# Altium schematic sheet LCD_big.SchDoc
size A4; SheetNumber: 2; SheetTotal: 2
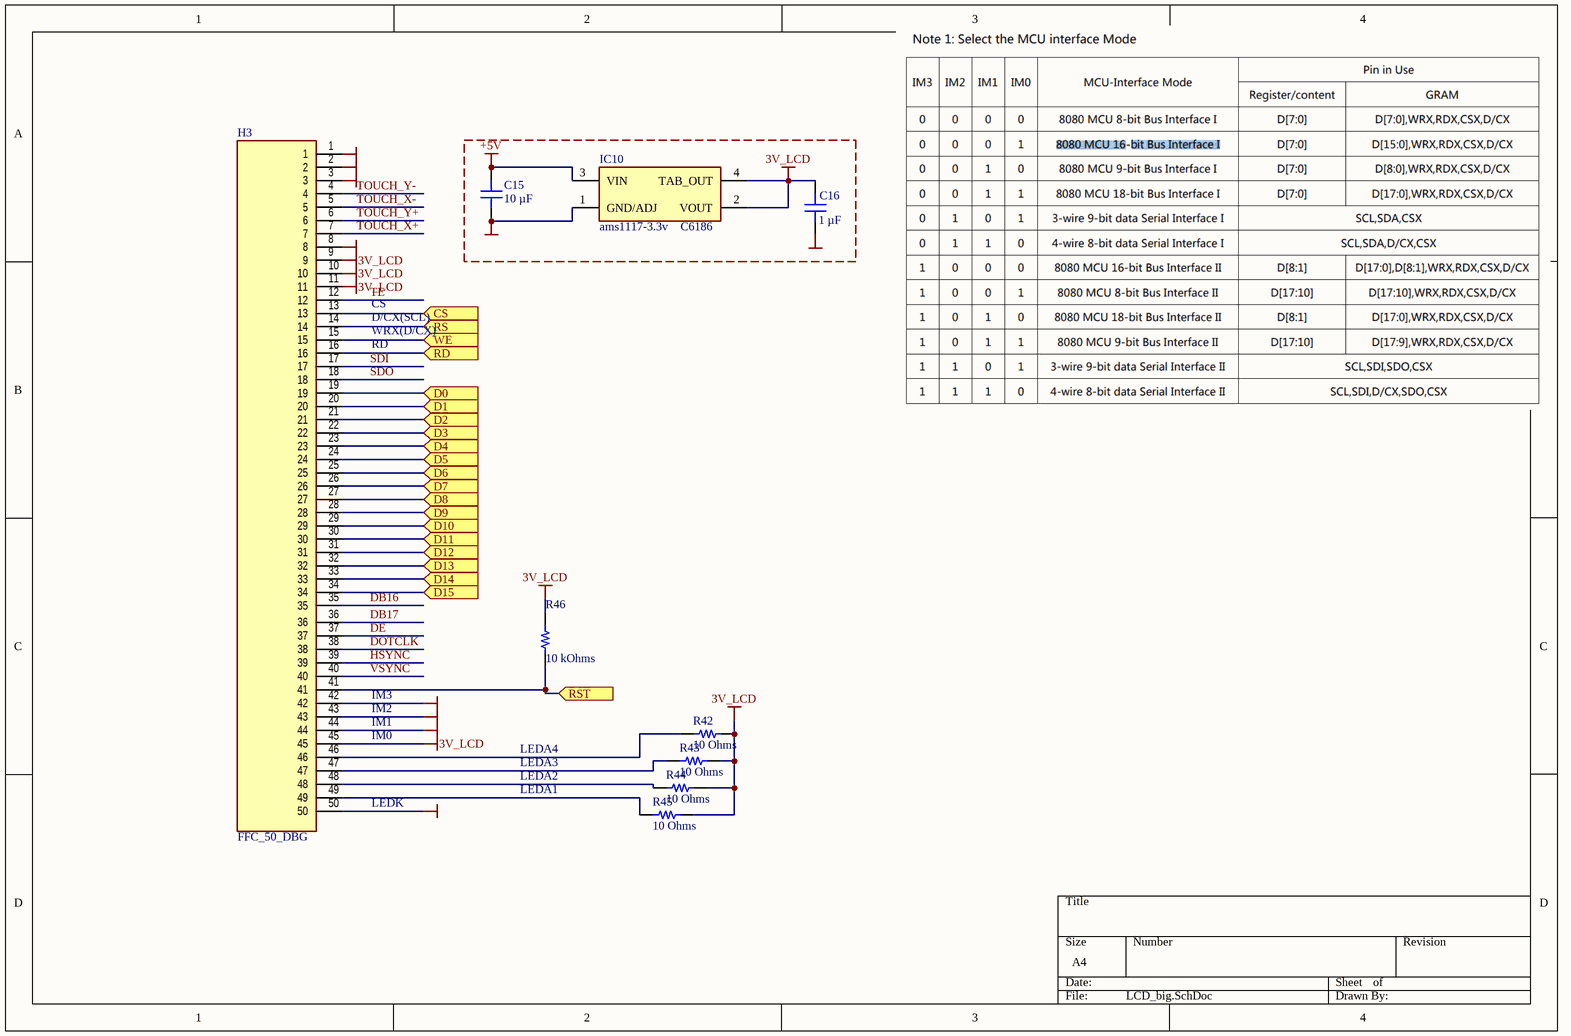
[diagram p0: LCD_big.SchDoc]

## Parts
C15  10 µF  [CAP 0805_2012]
C16  1 µF  [CAP 0805_2012]
H3  FFC_50_DBG  [FFC_50_DBG]
IC10  ams1117-3.3v  Supplier Part Number 1: C6186  [SOT-223]
R42  10 Ohms  [RES 0603_1608]
R43  10 Ohms  [RES 0603_1608]
R44  10 Ohms  [RES 0603_1608]
R45  10 Ohms  [RES 0603_1608]
R46  10 kOhms  [RES 0603_1608]

## Ports
CS (in), D0 (in), D1 (in), D2 (in), D3 (in), D4 (in), D5 (in), D6 (in), D7 (in), D8 (in), D9 (in), D10 (in), D11 (in), D12 (in), D13 (in), D14 (in), D15 (in), RD (in), RS (in), RST (in), WE (in)

## Nets
3V_LCD: C16.2 H3.9 H3.10 H3.11 H3.45 IC10.2(VOUT) IC10.4(TAB_OUT) R42.2 R43.2 R44.2 R45.2 R46.2
+5V: C15.2 IC10.3(VIN)
GND: C15.1 C16.1 H3.1 H3.2 H3.3 H3.8 H3.42 H3.43 H3.44 H3.50 IC10.1(GND/ADJ)
CS: H3.13 ; port CS
D0: H3.19 ; port D0
D1: H3.20 ; port D1
D2: H3.21 ; port D2
D3: H3.22 ; port D3
D4: H3.23 ; port D4
D5: H3.24 ; port D5
D6: H3.25 ; port D6
D7: H3.26 ; port D7
D8: H3.27 ; port D8
D9: H3.28 ; port D9
D10: H3.29 ; port D10
D11: H3.30 ; port D11
D12: H3.31 ; port D12
D13: H3.32 ; port D13
D14: H3.33 ; port D14
D15: H3.34 ; port D15
DB16: H3.35
DB17: H3.36
DE: H3.37
DOTCLK: H3.38
HSYNC: H3.39
RD: H3.16 ; port RD
RS: H3.14 ; port RS
RST: H3.41 R46.1 ; port RST
SDI: H3.17
SDO: H3.18
TE: H3.12
TOUCH_X+: H3.7
TOUCH_X-: H3.5
TOUCH_Y+: H3.6
TOUCH_Y-: H3.4
VSYNC: H3.40
WE: H3.15 ; port WE
NetH3_46: H3.46 R42.1
NetH3_47: H3.47 R43.1
NetH3_48: H3.48 R44.1
NetH3_49: H3.49 R45.1

## Notes on the sheet
- CS
- D/CX(SCL)
- WRX(D/CX)
- RD
- IM2
- IM3
- IM0
- IM1
- LEDA2
- LEDA3
- LEDA4
- LEDK
- LEDA1

## Library data of the parts
C15 = C0805C106K8PAC7800: CAP CER 10UF 10V X5R 0805; manufacturer: KEMET; Tolerance: ±10%; Part Number: C0805C106K8PAC7800; Value: 10 µF; Applications: Bypass, Decoupling; Capacitance: 10 µF; componentlink1description: Datasheet; componentlink1url: https://connect.kemet.com:7667/gateway/IntelliData-ComponentDocumentation/1.0/download/datasheet/C0805C106K8PACTU; componentlink2description: DigiKey Link; componentlink2url: https://www.digikey.com/en/products/detail/kemet/C0805C106K8PAC7800/1090830; Device Package: 0805 (2012 Metric); lastupdated: 9/14/2022 7:51:56 AM; Lifecycle Status: Active; Minimum Order: 1; Mounting Type: Surface Mount, MLCC; Operating Temperature: -55°C ~ 85°C; Package / Case: 0805 (2012 Metric); packaging: TapeAndReel; partid: 44790; Part Status: Active; price: 0.02; series: SMD Comm X5R; Size / Dimension: 0.079" L x 0.049" W (2.00mm x 1.25mm); Supplier 1: DigiKey; Supplier Part Number 1: 399-C0805C106K8PAC7800CT-ND; Temperature Coefficient: X5R; Thickness (Max): 0.055" (1.40mm); Voltage - Rated: 10V
C16 = C0805C105K4RAC7800: CAP CER 1UF 16V X7R 0805; manufacturer: KEMET; Tolerance: ±10%; Part Number: C0805C105K4RAC7800; Value: 1 µF; Applications: Bypass, Decoupling; Capacitance: 1 µF; componentlink1description: Datasheet; componentlink1url: https://api.kemet.com/component-edge/download/datasheet/C0805C105K4RACTU.pdf; componentlink2description: DigiKey Link; componentlink2url: https://www.digikey.com/en/products/detail/kemet/C0805C105K4RAC7800/416047; Device Package: 0805 (2012 Metric); lastupdated: 9/19/2022 1:03:30 PM; Lifecycle Status: Active; Minimum Order: 1; Mounting Type: Surface Mount, MLCC; Operating Temperature: -55°C ~ 125°C; Package / Case: 0805 (2012 Metric); packaging: TapeAndReel; partid: 32075; Part Status: Active; price: 0.01; series: SMD Comm X7R; Size / Dimension: 0.079" L x 0.049" W (2.00mm x 1.25mm); Supplier 1: DigiKey; Supplier Part Number 1: 399-C0805C105K4RAC7800CT-ND; Temperature Coefficient: X7R; Thickness (Max): 0.039" (1.00mm); Voltage - Rated: 16V
IC10 = ams1117-3.3v: Integrated Circuit; Manufacturer_Name: Advanced Monolithic Systems; Datasheet Link: http://www.advanced-monolithic.com/pdf/ds1117.pdf; Height: 1.8mm; Manufacturer_Part_Number: ams1117-3.3v; Supplier 1: LCSC
R42-R45 = ERJ-PA3F10R0V: RES SMD 10 OHM 1% 1/3W 0603; Manufacturer: Panasonic Electronic Components; Power (Watts): 0.333W, 1/3W; Temperature Coefficient: ±100ppm/°C; Part Number: ERJ-PA3F10R0V; Value: 10 Ohms; ComponentLink1Description: Datasheet; ComponentLink1URL: https://industrial.panasonic.com/cdbs/www-data/pdf/RDO0000/AOA0000C331.pdf; ComponentLink2Description: DigiKey Link; ComponentLink2URL: https://www.digikey.com/en/products/detail/panasonic-electronic-components/ERJ-PA3F10R0V/5035852; Composition: Thick Film; Device Package: 0603 (1608 Metric); Features: Automotive AEC-Q200, Pulse Withstanding; Height - Seated (Max): 0.022" (0.55mm); LastUpdated: 9/16/2023 7:33:50 PM; Lifecycle Status: Active; Minimum Order: 1; Number of Terminations: 2; Operating Temperature: -55°C ~ 155°C; Package / Case: 0603 (1608 Metric); Packaging: TapeAndReel; PartId: 5368; Part Status: Active; Price: 0.01; Ratings: AEC-Q200; Resistance: 10 Ohms; Series: ERJ-PA3; Size / Dimension: 0.063" L x 0.031" W (1.60mm x 0.80mm); Supplier 1: DigiKey; Supplier Part Number 1: P10.00BYCT-ND; Supplier Device Package: 0603; Tolerance: ±1%
R46 = RT0603FRE0710KL: RES SMD 10K OHM 1% 1/10W 0603; Manufacturer: Yageo; Power (Watts): 0.1W, 1/10W; Temperature Coefficient: ±50ppm/°C; Part Number: RT0603FRE0710KL; Value: 10 kOhms; ComponentLink1Description: Datasheet; ComponentLink1URL: https://www.yageo.com/upload/media/product/productsearch/datasheet/rchip/PYu-RT_1-to-0.01_RoHS_L_11.pdf; ComponentLink2Description: DigiKey Link; ComponentLink2URL: http://digikey.com/product-detail/en/yageo/RT0603FRE0710KL/YAG2321CT-ND/5252435; Composition: Thin Film; Device Package: 0603 (1608 Metric); Height - Seated (Max): 0.022" (0.55mm); LastUpdated: 9/2/2020 1:10:23 AM; Lifecycle Status: Active; Minimum Order: 1; Number of Terminations: 2; Operating Temperature: -55°C ~ 155°C; Package / Case: 0603 (1608 Metric); Packaging: TapeAndReel; PartId: 5671; Part Status: Active; Price: 0.01; Resistance: 10 kOhms; Series: RT; Size / Dimension: 0.063" L x 0.031" W (1.60mm x 0.80mm); Supplier 1: DigiKey; Supplier Part Number 1: YAG2321CT-ND; Supplier Device Package: 0603; Tolerance: ±1%